# Altium schematic sheet Flight_Controller_SCH.SchDoc
size A3; SheetNumber: 1; SheetTotal: 1
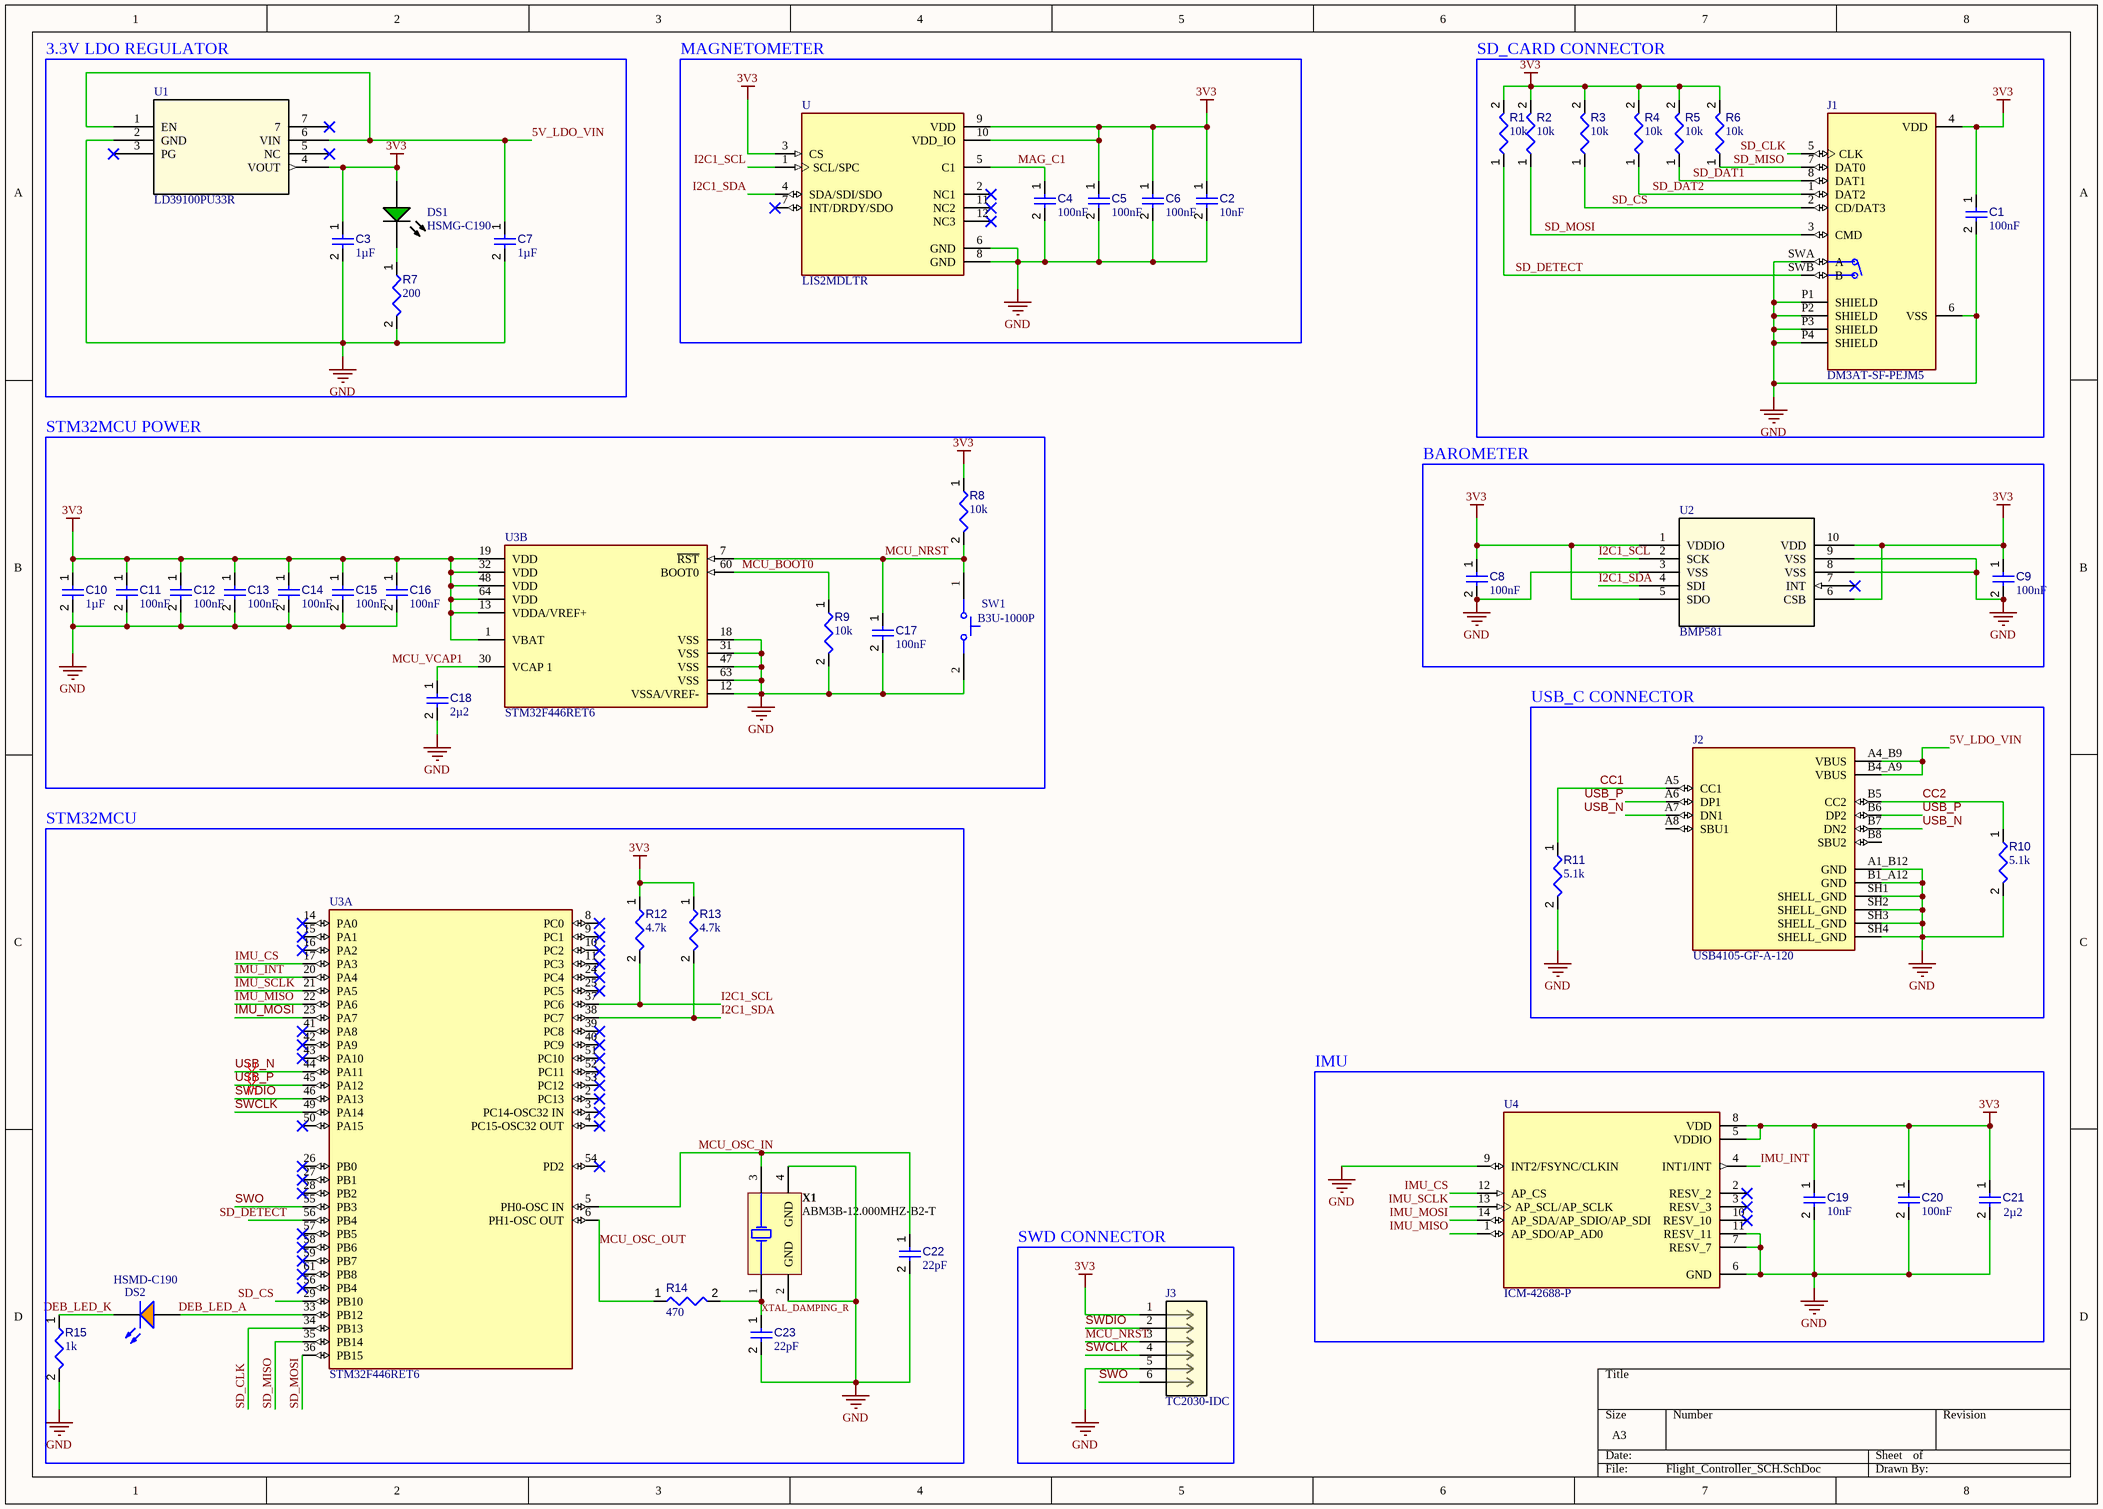
[diagram p0: Flight_Controller_SCH.SchDoc]

## Parts
C1  value 100nF  [CAPC0402(1005)60_L]  (hidden comment: Capacitor 100nF +/-20% 25V 0402)
C2  value 10nF  [CAPC0402(1005)60_L]  (hidden comment: Capacitor 10nF +/-20% 50V 0402)
C3  value 1µF  [CAPC1608X90X35ML15T15]  (hidden comment: Capacitor 1uF +/- 10% 16V 0603)
C4  value 100nF  [CAPC0402(1005)60_L]  (hidden comment: Capacitor 100nF +/-20% 25V 0402)
C5  value 100nF  [CAPC0402(1005)60_L]  (hidden comment: Capacitor 100nF +/-20% 25V 0402)
C6  value 100nF  [CAPC0402(1005)60_L]  (hidden comment: Capacitor 100nF +/-20% 25V 0402)
C7  value 1µF  [CAPC1608X90X35ML15T15]  (hidden comment: Capacitor 1uF +/- 10% 16V 0603)
C8  value 100nF  [CAPC0402(1005)60_L]  (hidden comment: Capacitor 100nF +/-20% 25V 0402)
C9  value 100nF  [CAPC0402(1005)60_L]  (hidden comment: Capacitor 100nF +/-20% 25V 0402)
C10  value 1µF  [CAPC1608X90X35ML15T15]  (hidden comment: Capacitor 1uF +/- 10% 16V 0603)
C11  value 100nF  [CAPC0402(1005)60_L]  (hidden comment: Capacitor 100nF +/-20% 25V 0402)
C12  value 100nF  [CAPC0402(1005)60_L]  (hidden comment: Capacitor 100nF +/-20% 25V 0402)
C13  value 100nF  [CAPC0402(1005)60_L]  (hidden comment: Capacitor 100nF +/-20% 25V 0402)
C14  value 100nF  [CAPC0402(1005)60_L]  (hidden comment: Capacitor 100nF +/-20% 25V 0402)
C15  value 100nF  [CAPC0402(1005)60_L]  (hidden comment: Capacitor 100nF +/-20% 25V 0402)
C16  value 100nF  [CAPC0402(1005)60_L]  (hidden comment: Capacitor 100nF +/-20% 25V 0402)
C17  value 100nF  [CAPC0402(1005)60_L]  (hidden comment: Capacitor 100nF +/-20% 25V 0402)
C18  value 2µ2  [CAPC0402(1005)60_L]  (hidden comment: Capacitor 2,2µF +/-20% 10V 0402)
C19  value 10nF  [CAPC0402(1005)60_L]  (hidden comment: Capacitor 10nF +/-20% 50V 0402)
C20  value 100nF  [CAPC1005X56X25LL10T15]  (hidden comment: Capacitor 0.1 uF +/- 5% 16 V 0402)
C21  value 2µ2  [CAPC0402(1005)60_L]  (hidden comment: Capacitor 2,2µF +/-20% 10V 0402)
C22  value 22pF  [CAPC0402(1005)60_L]  (hidden comment: Capacitor 22pF +/-10% 50V 0402)
C23  value 22pF  [CAPC0402(1005)60_L]  (hidden comment: Capacitor 22pF +/-10% 50V 0402)
DS1  HSMG-C190  [AVAG-HSMX-C190_V]
DS2  HSMD-C190  [AVAG-HSMX-C190_V]
J1  DM3AT-SF-PEJM5  [HRS_DM3AT-SF-PEJM5]
J2  USB4105-GF-A-120  [GCT_USB4105-GF-A-120]
J3  TC2030-IDC  [CONN_TC2030-IDC_TGC]
R1  value 10k  [RESC0402(1005)_L]  (hidden comment: Resistor 10K  +/-1 % 0402 63 mW)
R2  value 10k  [RESC0402(1005)_L]  (hidden comment: Resistor 10K  +/-1 % 0402 63 mW)
R3  value 10k  [RESC0402(1005)_L]  (hidden comment: Resistor 10K  +/-1 % 0402 63 mW)
R4  value 10k  [RESC0402(1005)_L]  (hidden comment: Resistor 10K  +/-1 % 0402 63 mW)
R5  value 10k  [RESC0402(1005)_L]  (hidden comment: Resistor 10K  +/-1 % 0402 63 mW)
R6  value 10k  [RESC0402(1005)_L]  (hidden comment: Resistor 10K  +/-1 % 0402 63 mW)
R7  value 200  [RESC0402(1005)_L]  (hidden comment: Resistor 10K  +/-1 % 0402 63 mW)
R8  value 10k  [RESC0402(1005)_L]  (hidden comment: Resistor 10K  +/-1 % 0402 63 mW)
R9  value 10k  [RESC0402(1005)_L]  (hidden comment: Resistor 10K  +/-1 % 0402 63 mW)
R10  value 5.1k  [RESC1005X40N]  (hidden comment: 0402WGF5101TCE)
R11  value 5.1k  [RESC1005X40N]  (hidden comment: 0402WGF5101TCE)
R12  value 4.7k  [RESC1005X40X25ML05T05]  (hidden comment: Resistor 4k7 +/-1% 0402 100 mW)
R13  value 4.7k  [RESC1005X40X25ML05T05]  (hidden comment: Resistor 4k7 +/-1% 0402 100 mW)
R14  value 470  [RESC0805(2012)_L]  (hidden comment: Resistor 470R +/-5% 0805 125 mW)
R15  value 1k  [RESC0402(1005)_L]  (hidden comment: Resistor 1K +/-5 % 0402 63 mW)
SW1  B3U-1000P  [OMRON-B3U-1000_V]
U  LIS2MDLTR  [LIS2MDLTR]
U1  LD39100PU33R  [DFN_00PU33R_STM]
U2  BMP581  [QFN10_BMP581_BOS-M]
U3  STM32F446RET6  [FP-LQFP64-5W-MFG]  (parts A,B of 2)
U4  ICM-42688-P  [ICM-42688-P]
X1  ABM3B-12.000MHZ-B2-T  [ABRA-ABM3B-4_V]

## Blocks framed on the sheet
3.3V LDO REGULATOR: C3 C7 DS1 R7 U1
MAGNETOMETER: C2 C4-C6 U
SD_CARD CONNECTOR: C1 J1 R1-R6
STM32MCU POWER: C10-C18 R8 R9 SW1 U3
BAROMETER: C8 C9 U2
USB_C CONNECTOR: J2 R10 R11
STM32MCU: C22 C23 DS2 R12-R15 U3 X1
IMU: C19-C21 U4
SWD CONNECTOR: J3

## Nets
3V3: C1.1 C2.1 C3.1 C5.1 C6.1 C8.1 C9.1 C10.1 C11.1 C12.1 C13.1 C14.1 C15.1 C16.1 C19.1 C20.1 C21.1 DS1.1(A) J1.4(VDD) J3.1 R1.2 R2.2 R3.2 R4.2 R5.2 R6.2 R8.1 R12.1 R13.1 U.3(CS) U.9(VDD) U.10(VDD_IO) U1.4(VOUT) U2.1(VDDIO) U2.5(SDO) U2.6(CSB) U2.10(VDD) U3.1(VBAT) U3.13(VDDA/VREF+) U3.19(VDD) U3.32(VDD) U3.48(VDD) U3.64(VDD) U4.5(VDDIO) U4.8(VDD)
GND: C1.2 C2.2 C3.2 C4.2 C5.2 C6.2 C7.2 C8.2 C9.2 C10.2 C11.2 C12.2 C13.2 C14.2 C15.2 C16.2 C17.2 C18.2 C19.2 C20.2 C21.2 C22.2 C23.2 J1.6(VSS) J1.P1(SHIELD) J1.P2(SHIELD) J1.P3(SHIELD) J1.P4(SHIELD) J1.SWA(A) J2.A1_B12(GND) J2.B1_A12(GND) J2.SH1(SHELL_GND) J2.SH2(SHELL_GND) J2.SH3(SHELL_GND) J2.SH4(SHELL_GND) J3.5 R7.2 R9.2 R10.2 R11.2 R15.2 SW1.2 U.6(GND) U.8(GND) U1.2(GND) U2.3(VSS) U2.8(VSS) U2.9(VSS) U3.12(VSSA/VREF-) U3.18(VSS) U3.31(VSS) U3.47(VSS) U3.63(VSS) U4.6(GND) U4.7(RESV_7) U4.9(INT2/FSYNC/CLKIN) U4.11(RESV_11) X1.2(GND) X1.4(GND)
5V_LDO_VIN: C7.1 J2.A4_B9(VBUS) J2.B4_A9(VBUS) U1.1(EN) U1.6(VIN)
CC1: J2.A5(CC1) R11.1
CC2: J2.B5(CC2) R10.1
DEB_LED_A: DS2.1(A) U3.33(PB12)
DEB_LED_K: DS2.2(K) R15.1
I2C1_SCL: R12.2 U.1(SCL/SPC) U2.2(SCK) U3.37(PC6)
I2C1_SDA: R13.2 U.4(SDA/SDI/SDO) U2.4(SDI) U3.38(PC7)
IMU_CS: U3.17(PA3) U4.12(AP_CS)
IMU_INT: U3.20(PA4) U4.4(INT1/INT)
IMU_MISO: U3.22(PA6) U4.1(AP_SDO/AP_AD0)
IMU_MOSI: U3.23(PA7) U4.14(AP_SDA/AP_SDIO/AP_SDI)
IMU_SCLK: U3.21(PA5) U4.13(AP_SCL/AP_SCLK)
MAG_C1: C4.1 U.5(C1)
MCU_BOOT0: R9.1 U3.60(BOOT0)
MCU_NRST: C17.1 J3.3 R8.2 SW1.1 U3.7(~{RST})
MCU_OSC_IN: C22.1 U3.5(PH0-OSC_IN) X1.3(X2)
MCU_OSC_OUT: R14.1 U3.6(PH1-OSC_OUT)
MCU_VCAP1: C18.1 U3.30(VCAP_1)
SD_CLK: J1.5(CLK) U3.34(PB13)
SD_CS: J1.2(CD/DAT3) R3.1 U3.29(PB10)
SD_DAT1: J1.8(DAT1) R5.1
SD_DAT2: J1.1(DAT2) R4.1
SD_DETECT: J1.SWB(B) R1.1 U3.56(PB4)
SD_MISO: J1.7(DAT0) R6.1 U3.35(PB14)
SD_MOSI: J1.3(CMD) R2.1 U3.36(PB15)
SWCLK: J3.4 U3.49(PA14)
SWDIO: J3.2 U3.46(PA13)
SWO: J3.6 U3.55(PB3)
USB_N: J2.A7(DN1) J2.B7(DN2) U3.44(PA11)
USB_P: J2.A6(DP1) J2.B6(DP2) U3.45(PA12)
XTAL_DAMPING_R: C23.1 R14.2 X1.1(X1)
NetDS1_2: DS1.2(K) R7.1

Not connected (* = marked no-connect by the designer): J2 A8(SBU1) B8(SBU2); U 2(NC1)* 7(INT/DRDY/SDO)* 11(NC2)* 12(NC3)*; U1 3(PG)* 5(NC)* 7*; U2 7(INT)*; U3 2(PC13)* 3(PC14-OSC32_IN)* 4(PC15-OSC32_OUT)* 8(PC0)* 9(PC1)* 10(PC2)* 11(PC3)* 14(PA0)* 15(PA1)* 16(PA2)* 24(PC4)* 25(PC5)* 26(PB0)* 27(PB1)* 28(PB2)* 39(PC8)* 40(PC9)* 41(PA8)* 42(PA9)* 43(PA10)* 50(PA15)* 51(PC10)* 52(PC11)* 53(PC12)* 54(PD2)* 57(PB5)* 58(PB6)* 59(PB7)* 61(PB8)*; U4 2(RESV_2)* 3(RESV_3)* 10(RESV_10)*

## Layout directives
differential pair: USB_N, USB_P

## Library data of the parts
C1 C4-C6 C8 C9 C11-C17 = CMP-001-00065-4: Chip Capacitor, 100nF +/-20%, 25V, 0402, Thickness 0.6 mm; Tolerance: 10%; Max Operating Temperature: 85°C; Min Operating Temperature: -55°C; Pins: 2; Voltage Rating: 25V; Mounting Technology: SMT; Case/Package: 0402
C2 C19 = CMP-001-00069-3: Chip Capacitor, 10nF +/-20%, 50V, 0402, Thickness 0.6 mm; Tolerance: 5%; Max Operating Temperature: 85°C; Pins: 2; Case/Package: 0402; Voltage Rating: 50V; Min Operating Temperature: -55°C; Mounting Technology: SMT
C3 C7 C10 = CMP-001-00004-6: Chip Capacitor, 1 uF, +/- 10%, 16 V, 0603 (1608 Metric); Capacitor Type: Ceramic; Mounting Technology: SM; RoHS Compliant: True; Min Operating Temperature: -55°C; Case/Package: 0603; Pins: 2; Voltage Rating: 16V; Max Operating Temperature: 125°C; Tolerance: 10%
C18 C21 = CMP-001-00056-4: Chip Capacitor, 2,2µF +/-20%, 10V, 0402, Thickness 0.6 mm; Tolerance: 10%; Mounting Technology: SMT; Max Operating Temperature: 85°C; Case/Package: 0402; Pins: 2; Min Operating Temperature: -55°C; Voltage Rating: 10V
C20 = CMP-001-00001-6: Chip Capacitor, 0.1 uF, +/- 5%, 16 V, 0402 (1005 Metric); Capacitor Type: Ceramic; Voltage Rating: 16V; Max Operating Temperature: 125°C; Min Operating Temperature: -55°C; Case/Package: 0402; Mounting Technology: SM; Pins: 2; Tolerance: 5%; RoHS Compliant: True
C22 C23 = CMP-001-00073-3: Chip Capacitor, 22pF +/-10%, 50V, 0402, Thickness 0.6 mm; Tolerance: 10%; Pins: 2; Voltage Rating: 50V; Max Operating Temperature: 85°C; Min Operating Temperature: -55°C; Mounting Technology: SMT; Case/Package: 0402
DS1 = CMP-007-00013-2: LED Uni-Color Green, 52 mW, 20 mA, -40 to 85 degC, 2-Pin SMD, RoHS, Tape and Reel; Manufacturer: Avago; Forward Current: 20mA; Viewing Angle: 170degrees; Luminous Intensity: 15mcd; Lens Style: Diffused; Forward Voltage: 2.2V; Power: 52mW; Mounting Technology: SM; RoHS Compliant: True; Packaging: TapeandReel; Illumination Colour: Green; Datasheet URL: http://docs.avagotech.com/docs/AV02-0551EN; Min Operating Temperature: -40°C; Max Operating Temperature: 85°C; Pins: 2; Package Description: 2-Pin Surface Mount Device, Body 1.6 x 0.8 mm, Height 0.9 mm; Nominal Vf: 2.2V; Case/Package: 0603; Manufacturer URL: http://www.avagotech.com/; Datasheet Version: Mar-12; Colour: Green; Package Reference: HSMX-C190; Package Quantity: 4000
DS2 = CMP-007-00012-2: LED Uni-Color Orange, 52 mW, 20 mA, -40 to 85 degC, 2-Pin SMD, RoHS, Tape and Reel; Manufacturer: Avago; Lens Style: Diffused; Forward Voltage: 2.2V; Forward Current: 20mA; Viewing Angle: 170degrees; Power: 52mW; Luminous Intensity: 8mcd; Min Operating Temperature: -40°C; Packaging: TapeandReel; Colour: Orange; Nominal Vf: 2.2V; Pins: 2; Case/Package: 0603; Max Operating Temperature: 85°C; Illumination Colour: Orange; Package Description: 2-Pin Surface Mount Device, Body 1.6 x 0.8 mm, Height 0.9 mm; Manufacturer URL: http://www.avagotech.com/; Datasheet Version: Mar-12; RoHS Compliant: True; Datasheet URL: http://docs.avagotech.com/docs/AV02-0551EN; Mounting Technology: SM; Package Reference: HSMX-C190; Package Quantity: 4000
J1 = DM3AT-SF-PEJM5: 10 (8 + 2) Position Card Connector Secure Digital - microSDâ„¢ Surface Mount, Right Angle Gold; Manufacturer: Hirose Electric Co Ltd; Datasheet: https://www.hirose.com/product/document?clcode=CL0609-0033-6-00&productname=DM3AT-SF-PEJ2M5&series=DM3&documenttype=Catalog&lang=en&documentid=D49662_en; Price: $3.18000; Link: https://www.digikey.com/en/products/detail/hirose-electric-co-ltd/DM3AT-SF-PEJM5/2533565
J2 = CMP-002-00071-1: USB CONN, 2.0 TYPE C, RCPT, 16POS, SMT; USB Connector Type:USB Type C; USB Standard:USB 2.0; Gender:Receptacle; No. of Positions:16Positions; Connector Mounting:Surface Mount, Through Hole Mount; Orientation:Right Angle RoHS Compliant: Yes; MF: Global Connector Technology; Price: $0.80000; DataSheet: https://gct.co/files/specs/usb4105-spec.pdf
J3 = TC2030-IDC: Description; Datasheet: https://mm.digikey.com/Volume0/opasdata/d220001/medias/docus/2084/TC2030-IDC_RevB.pdf; Price: $44.58000; MFN: TC2030-IDC; Link: https://www.digikey.com/en/products/detail/tag-connect-llc/TC2030-IDC/4571121
R1-R9 = CMP-009-00149-3: Chip Resistor, 10 kOhms, +/-1 %, 63 mW, -55 to 125 degC, 0402; Power: 63mW; Tolerance: 1%; Min Operating Temperature: -55°C; Case/Package: 0402; Max Operating Temperature: 155°C; Pins: 2
R10 R11 = CMP-009-00177-1: Res Thick Film 0402 5.1K Ohm 1% 0.063W(1/16W) ±100ppm/C Pad SMD T/R; Tolerance: 1%; Case/Package: 0402
R12 R13 = CMP-009-00030-5: Chip Resistor, 4.7 KOhm, +/- 1%, 0.1 W, -55 to 155 degC, 0402 (1005 Metric); Power: 100mW; Voltage Rating: 50V; Mounting Technology: SM; RoHS Compliant: True; Tolerance: 1%; Min Operating Temperature: -55°C; Max Operating Temperature: 155°C; Case/Package: 0402; Pins: 2
R14 = CMP-009-00122-3: Chip Resistor, 470 Ohms, +/-5%, 125 mW, -55 to 155 degC, 0805; Tolerance: 5%; Power: 125mW; Max Operating Temperature: 155°C; Case/Package: 0805; Pins: 2; Min Operating Temperature: -55°C
R15 = CMP-009-00157-3: Chip Resistor, 1 kOhms, +/-5 %, 63 mW, -55 to 155 degC, 0402; Tolerance: 5%; Power: 63mW; Case/Package: 0402; Pins: 2; Min Operating Temperature: -55°C; Max Operating Temperature: 155°C
SW1 = CMP-011-00000-2: Tactile Switch, SPST-NO, 0.05 A, 12 V, -25 to 70 degC, 2-Pin SMD, RoHS, Tape and Reel; Manufacturer: Omron Electronic Components; IP Rating: IP40; Current Rating: 50mA; Max Contact Resistance: 100mohm; Operating Force: 153gf; Throw Configuration: SPST; Resistance: 0.1Ohm; Max Voltage Rating (DC): 12V; Contact Material: Silver; Max Current Rating: 50mA; Datasheet URL: http://www.omron.com/ecb/products/pdf/en-b3u.pdf; Mounting Technology: SM; Case/Package: B3U-1000; Packaging: TapeandReel; Package Reference: B3U-1000; Manufacturer URL: http://www.omron.com/; Datasheet Version: Jan-15; RoHS Compliant: True; Max Operating Temperature: 70°C; Contact Current Rating: 50mA; Package Quantity: 3500; Package Description: 2-Pin Surface Mount Device, Body 3 x 2.5 mm; Voltage Rating (DC): 12V; Min Operating Temperature: -25°C; Voltage Rating: 12V
U = LIS2MDLTR: Magnetoresistive Sensor X, Y, Z Axis 12-LGA _2x2_; Manufacturer: STMicroelectronics; Datasheet: https://www.st.com/content/ccc/resource/technical/document/datasheet/group3/29/13/d1/e0/9a/4d/4f/30/DM00395193/files/DM00395193.pdf/jcr:content/translations/en.DM00395193.pdf; Price: $2.75000; Link: https://www.digikey.com/en/products/detail/stmicroelectronics/LIS2MDLTR/7348328?s=N4IgTCBcDaIDIEkDKYCyAROAVASiAugL5A
U1 = LD39100PU33R: 1 A low quiescent current low noise voltage regulator; Manufacturer_Name: STMicroelectronics; Manufacturer_Part_Number: LD39100PU33R; Datasheet: https://www.st.com/content/ccc/resource/technical/document/datasheet/72/02/e5/ee/df/36/40/5e/CD00233788.pdf/files/CD00233788.pdf/jcr:content/translations/en.CD00233788.pdf; Price: $1.15000
U2 = BMP581: No Description Available; Manufacturer_Name: Bosch Sensortec; Copyright: Copyright (C) 2026 Ultra Librarian. All rights reserved.; Manufacturer_Part_Number: BMP581; Datasheet: https://www.bosch-sensortec.com/media/boschsensortec/downloads/datasheets/bst-bmp581-ds004.pdf
U3 = CMP-12105-000007-1: IC MCU 32BIT 512KB FLASH 64LQFP; Manufacturer: ST; Number Of Spi Channels: 4; Ram Size: 128KBytes; Standoff Height: 0.05mm; Number Of Uart Channels: 6; Number Of Pwm Channels: 32; Max Junction Temp: +105°C; Number Of I/Os: 50; Number Of Usb Channels: 2; Frequency: 180MHz; Number Of A/D Converters: 3; Max Supply Voltage: 3.6V; Number Of Adc Channels: 16; Interface: I2C,SPI,UART,USART,CAN,USB,LIN,IrDA,I2S,Other; Memory Size: 512KBytes; Number Of Timers/Counters: 14; Min Supply Voltage: 1.7V; Core Architecture: ARM Cortex-M4; Data Bus Width: 32bits; Number Of Cores: 1; Ambient Temperature Range Low: -40°C; ComponentLink2URL: https://www.st.com/en/microcontrollers-microprocessors/stm32f446re.html; Category: IC; Height: 1.6mm; Ipc Land Pattern Name: QFP50P1200X1200X160-64; Manufacturer Part Number: STM32F446RET6; Octopart: https://octopart.com/stm32f446ret6-stmicroelectronics-52642920; Temperature Range High: +105°C; Lead Free: Yes; Mouser Description: ARM Microcontrollers - MCU High-performance and DSP with FP, ARM Cortex-M4 MCU with 512 Kbytes Flash, 180 MHz CPU, Art Accelerator, SDRAM; Digikey Description: IC MCU 32BIT 512KB FLASH 64LQFP; Ambient Temperature Range High: +85°C; Number Of I2C Channels: 4; Memory Type: FLASH; RoHS: TRUE; Automotive: No; Device Class L1: Integrated Circuits (ICs); Temperature: -40°C to +105°C; Device Class L2: Embedded Processors and Controllers; Device Class L3: Microcontrollers; Temperature Range Low: -40°C; Package: LQFP64-5W; ComponentLink2Description: Datasheet
U4 = ICM-42688-P: Accelerometer, Gyroscope, 6 Axis Sensor Output; Package: None; MP: ICM-42688-P; Value: *; Availability: Unavailable; Price: None
X1 = CMP-003-00015-2: Ceramic SMD Crystal, 12 MHz, +/- 20 ppm, 18 pF, -20 to 70 degC, 4-Pin SMD, RoHS, Tape and Reel; Manufacturer: Abracon; ESR: 70; Load Capacitance: 18pF; Tolerance: 20ppm; Frequency: 12MHz; Resistance: 70Ohm; Mounting Technology: SM; Packaging: TapeandReel; Datasheet URL: http://www.abracon.com/Resonators/abm3b.pdf; Manufacturer URL: http://www.abracon.com/; RoHS Compliant: True; Frequency Tolerance: 20ppm; Datasheet Version: Aug-15; Max Operating Temperature: 70°C; Package Reference: ABM3B; Min Operating Temperature: -20°C; Pins: 4; Package Quantity: 1000; Package Description: 4-Pin Surface Mount Device, Body 5 x 3.2 mm; Case/Package: CSMD